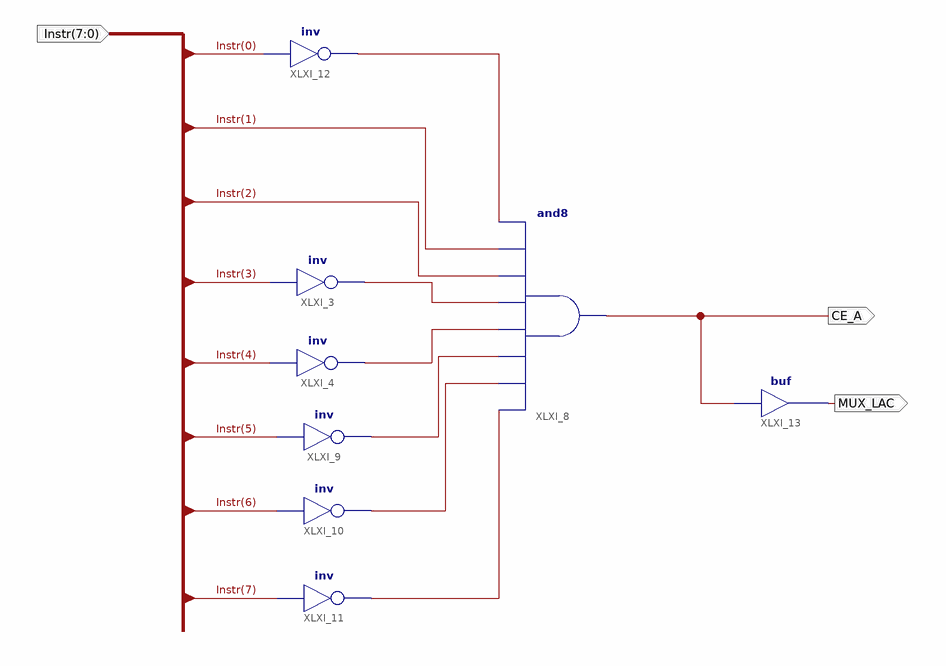
[diagram p0: schematic sheet 1]
// Xilinx ISE schematic instrLAC.sch (spartan3e) as structural Verilog: 8 symbols, 3 ports
module instrLAC (
  input  [7:0] Instr,
  output CE_A,
  output MUX_LAC
);

  wire XLXN_4, XLXN_5, XLXN_6, XLXN_7, XLXN_10, XLXN_15;

  not XLXI_3 (XLXN_4, Instr[3]);
  not XLXI_4 (XLXN_5, Instr[4]);
  not XLXI_9 (XLXN_6, Instr[5]);
  not XLXI_10 (XLXN_7, Instr[6]);
  not XLXI_11 (XLXN_10, Instr[7]);
  and XLXI_8 (CE_A, XLXN_10, XLXN_7, XLXN_6, XLXN_5, XLXN_4, Instr[2], Instr[1], XLXN_15);
  not XLXI_12 (XLXN_15, Instr[0]);
  buf XLXI_13 (MUX_LAC, CE_A);
endmodule
